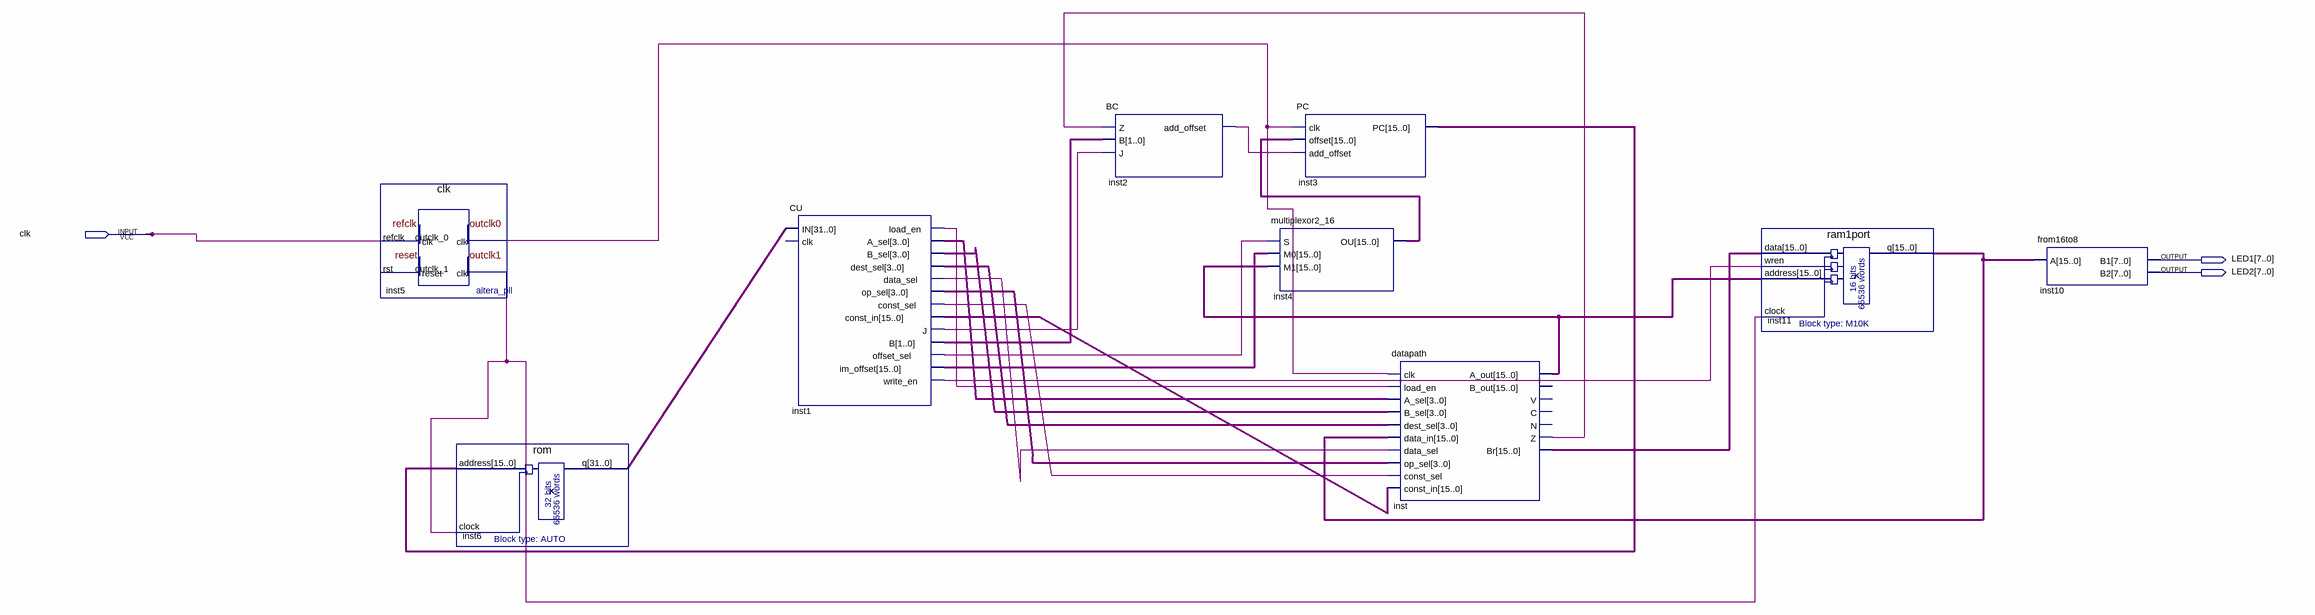
[diagram p0: schematic sheet]
// Quartus schematic proc.bdf as structural Verilog: 9 symbols, 3 pins
module proc (
  input  clk,
  output [7:0] LED1,
  output [7:0] LED2
);

  wire inst1_const_sel, inst1_data_sel, inst1_j, inst1_load_en, inst1_offset_sel, inst1_write_en,
       inst2_add_offset, inst5_outclk_0, inst5_outclk_1, inst_z;
  wire [1:0] inst1_b;
  wire [3:0] inst1_a_sel, inst1_b_sel, inst1_dest_sel, inst1_op_sel;
  wire [15:0] inst1_const_in, inst1_im_offset, inst3_pc, inst4_ou, inst11_q, inst_a_out, inst_br;
  wire [31:0] inst6_q;

  clk inst5 (.refclk(clk), .outclk_0(inst5_outclk_0), .outclk_1(inst5_outclk_1));  // open: rst
  rom inst6 (.address(inst3_pc), .clock(inst5_outclk_1), .q(inst6_q));
  CU inst1 (
    .IN(inst6_q), .load_en(inst1_load_en), .A_sel(inst1_a_sel), .B_sel(inst1_b_sel),
    .dest_sel(inst1_dest_sel), .data_sel(inst1_data_sel), .op_sel(inst1_op_sel), .const_sel(inst1_const_sel),
    .const_in(inst1_const_in), .J(inst1_j), .B(inst1_b), .offset_sel(inst1_offset_sel),
    .im_offset(inst1_im_offset), .write_en(inst1_write_en));  // open: clk
  BC inst2 (.Z(inst_z), .B(inst1_b), .J(inst1_j), .add_offset(inst2_add_offset));
  multiplexor2_16 inst4 (.S(inst1_offset_sel), .M0(inst1_im_offset), .M1(inst_a_out), .OU(inst4_ou));
  PC inst3 (.clk(inst5_outclk_0), .offset(inst4_ou), .add_offset(inst2_add_offset), .PC(inst3_pc));
  datapath inst (
    .clk(inst5_outclk_0), .load_en(inst1_load_en), .A_sel(inst1_a_sel), .B_sel(inst1_b_sel),
    .dest_sel(inst1_dest_sel), .data_in(inst11_q), .data_sel(inst1_data_sel), .op_sel(inst1_op_sel),
    .const_sel(inst1_const_sel), .const_in(inst1_const_in), .A_out(inst_a_out), .Z(inst_z), .Br(inst_br));  // open: B_out, V, C, N
  ram1port inst11 (.data(inst_br), .wren(inst1_write_en), .address(inst_a_out), .clock(inst5_outclk_1), .q(inst11_q));
  from16to8 inst10 (.A(inst11_q), .B1(LED1), .B2(LED2));
endmodule
